# Altium schematic sheet main.SchDoc
size A4
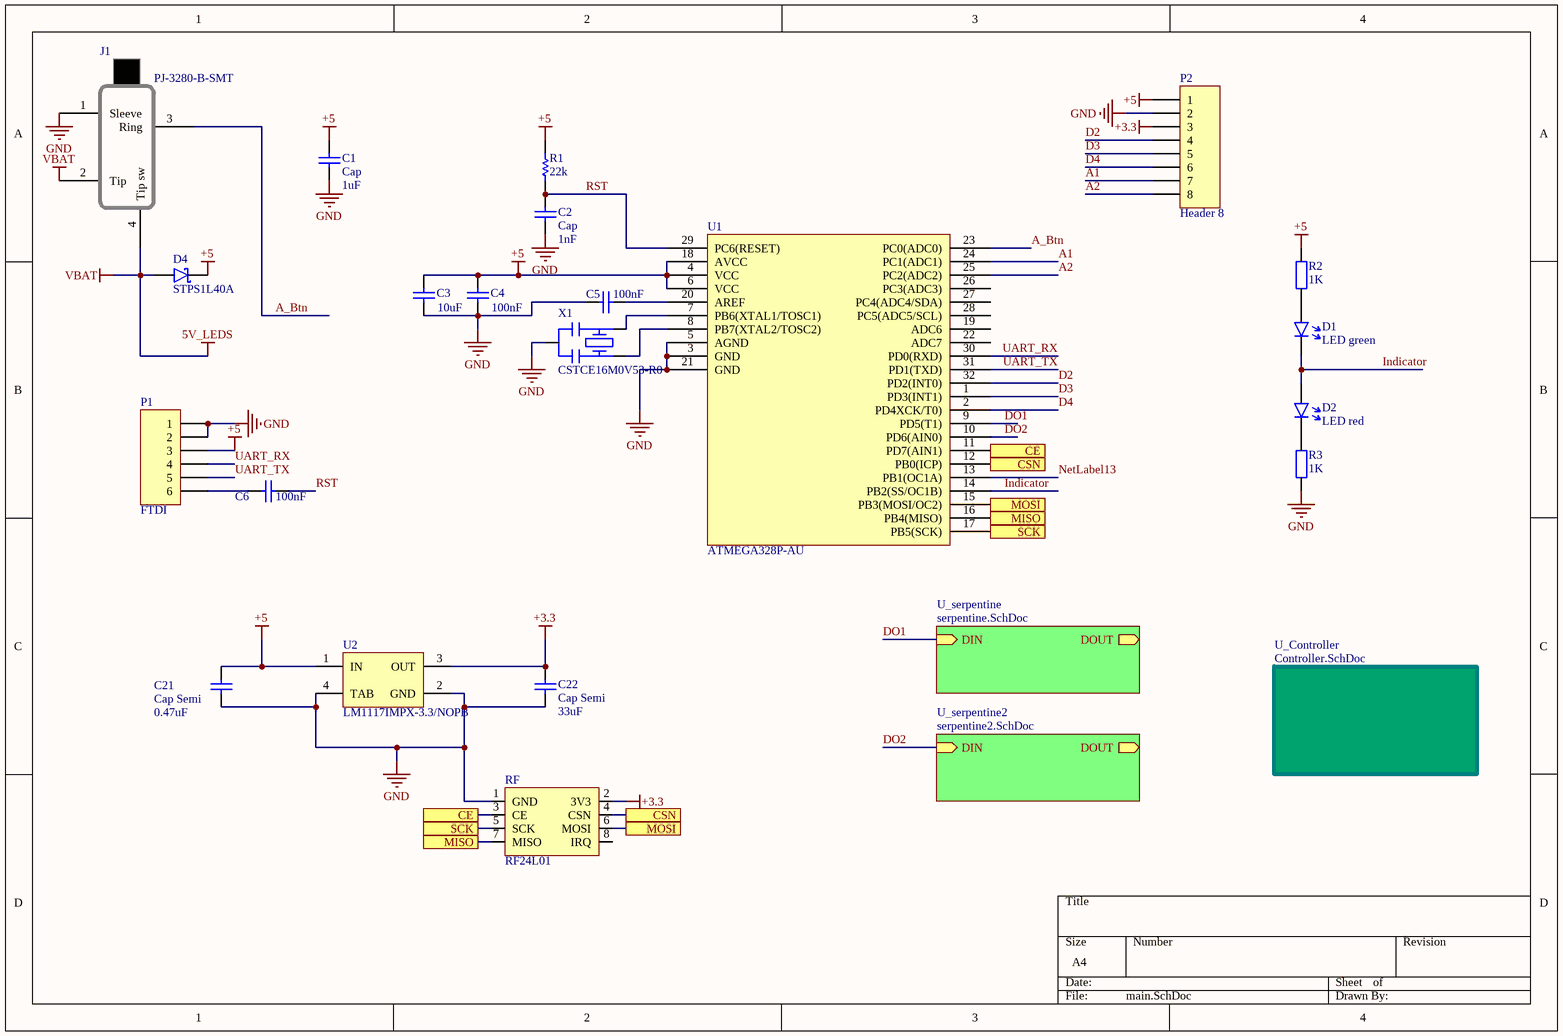
[diagram p0: main.SchDoc]

## Parts
C1  Cap  value 1uF  [6-0805_M]
C2  Cap  value 1nF  [6-0805_N]
C3  value 10uF  [6-0805_N]  (hidden comment: Cap)
C4  value 100nF  [6-0805_N]  (hidden comment: Cap)
C5  value 100nF  [6-0805_N]  (hidden comment: Cap)
C6  value 100nF  [6-0805_N]  (hidden comment: Cap)
C21  Cap Semi  value 0.47uF  [C1206]
C22  Cap Semi  value 33uF  [C1206]
D1  LED green  [LED0805]
D2  LED red  [LED0805]
D4  STPS1L40A  [schottky smd]
J1  PJ-3280-B-SMT  [Phonejack]
P1  FTDI  [HDR1X6H]
P2  Header 8  [HDR1X8]
R1  22k  [6-0805_N]
R2  1K  [RES0805]
R3  1K  [RES0805]
RF  RF24L01  [RF]
U1  ATMEGA328P-AU  [TQFP32]
U2  LM1117IMPX-3.3/NOPB  [DCY0004A_N]
X1  CSTCE16M0V53-R0  [osc]

## Sub-sheets
U_Controller = Controller.SchDoc: no entries
U_serpentine = serpentine.SchDoc: DIN (in), DOUT (out)
U_serpentine2 = serpentine2.SchDoc: DIN (in), DOUT (out)

## Ports
CE, CSN, MISO, MOSI, SCK

## Nets
5V_LEDS: D4.1(A) J1.2(Tip) J1.4(Tip_sw)  [also labelled VBAT]
+3.3: C22.2 P2.3 RF.2(3V3) U2.3(OUT)
+5: C1.1 C3.1 C4.1 C21.2 D4.2(C) P1.3 P2.1 R1.2 R2.1 U1.4(VCC) U1.6(VCC) U1.18(AVCC) U2.1(IN)
GND: C1.2 C2.1 C3.2 C4.2 C5.2 C21.1 C22.1 J1.1(Sleeve) P1.1 P1.2 P2.2 R3.2 RF.1(GND) U1.3(GND) U1.5(AGND) U1.21(GND) U2.2(GND) U2.4(TAB) X1.GND
A1: P2.7 U1.24(PC1(ADC1))
A2: P2.8 U1.25(PC2(ADC2))
A_Btn: J1.3(Ring) U1.23(PC0(ADC0))
CE: RF.3(CE) U1.11(PD7(AIN1)) ; port CE
CSN: RF.4(CSN) U1.12(PB0(ICP)) ; port CSN
D2: P2.4 U1.32(PD2(INT0))
D3: P2.5 U1.1(PD3(INT1))
D4: P2.6 U1.2(PD4XCK/T0))
DO1: U1.9(PD5(T1)) ; sheet U_serpentine/DIN
DO2: U1.10(PD6(AIN0)) ; sheet U_serpentine2/DIN
Indicator: D1.2 D2.1(A) U1.14(PB2(SS/OC1B))
MISO: RF.7(MISO) U1.16(PB4(MISO)) ; port MISO
MOSI: RF.6(MOSI) U1.15(PB3(MOSI/OC2)) ; port MOSI
NetLabel13: U1.13(PB1(OC1A))
RST: C2.2 C6.1 R1.1 U1.29(PC6(RESET))
SCK: RF.5(SCK) U1.17(PB5(SCK)) ; port SCK
UART_RX: P1.4 U1.30(PD0(RXD))
UART_TX: P1.5 U1.31(PD1(TXD))
NetC5_1: C5.1 U1.20(AREF)
NetC6_2: C6.2 P1.6
NetD1_1: D1.1(A) R2.2
NetD2_2: D2.2 R3.1
NetU1_7: U1.7(PB6(XTAL1/TOSC1)) X1.OSCO
NetU1_8: U1.8(PB7(XTAL2/TOSC2)) X1.OSCI

Not connected (* = marked no-connect by the designer): RF 8(IRQ); U1 19(ADC6) 22(ADC7) 26(PC3(ADC3)) 27(PC4(ADC4/SDA)) 28(PC5(ADC5/SCL))

## Library data of the parts
C1 = Cap: C107456; Published: 8-Jun-2000; LatestRevisionDate: 17-Jul-2002; LatestRevisionNote: Re-released for DXP Platform.; PackageReference: RAD-0.3; Publisher: Altium Limited; PackageDescription: Radial Cap, Thru-Hole; 2 Leads; 0.3 in Pin Spacing
C2 = Cap: C393688; Published: 8-Jun-2000; LatestRevisionDate: 17-Jul-2002; LatestRevisionNote: Re-released for DXP Platform.; PackageReference: RAD-0.3; Publisher: Altium Limited; PackageDescription: Radial Cap, Thru-Hole; 2 Leads; 0.3 in Pin Spacing
C3 = Cap: C40894; Published: 8-Jun-2000; LatestRevisionDate: 17-Jul-2002; LatestRevisionNote: Re-released for DXP Platform.; PackageReference: RAD-0.3; Publisher: Altium Limited; PackageDescription: Radial Cap, Thru-Hole; 2 Leads; 0.3 in Pin Spacing
C4-C6 = Cap: C282730; Published: 8-Jun-2000; LatestRevisionDate: 17-Jul-2002; LatestRevisionNote: Re-released for DXP Platform.; PackageReference: RAD-0.3; Publisher: Altium Limited; PackageDescription: Radial Cap, Thru-Hole; 2 Leads; 0.3 in Pin Spacing
C21 = Cap Semi: C161276; Published: 8-Jun-2000; LatestRevisionDate: 29-May-2009; LatestRevisionNote: IPC-7351 Footprint Added.; PackageReference: C1206; Publisher: Altium Limited; PackageDescription: Chip Capacitor
C22 = Cap Semi: C342307; Published: 8-Jun-2000; LatestRevisionDate: 29-May-2009; LatestRevisionNote: IPC-7351 Footprint Added.; PackageReference: C1206; Publisher: Altium Limited; PackageDescription: Chip Capacitor
D1 = LED single: C84260
D2 = LED single: C84256
D4 = schottky: C165940
J1 = Phonejack: C381130
P1 = Header 6H: Header, 6-Pin, Right Angle; LatestRevisionDate: 17-Jul-2002; LatestRevisionNote: Re-released for DXP Platform.; Publisher: Altium Limited
P2 = Header 8: Header, 8-Pin; LatestRevisionDate: 17-Jul-2002; LatestRevisionNote: Re-released for DXP Platform.; Publisher: Altium Limited
R1 = Res1: C269535; Published: 8-Jun-2000; LatestRevisionDate: 17-Jul-2002; LatestRevisionNote: Re-released for DXP Platform.; PackageReference: AXIAL-0.3; Publisher: Altium Limited; PackageDescription: Axial Device, Thru-Hole; 2 Leads; 0.3 in Pin Spacing; Value: 22k
R2 R3 = Resistor: C269744
U1 = ATmega328: C14877
U2 = CMP-0062-01784-3: C23984; Manufacturer: Texas Instruments; PowerWise: N; CompType: LDO IC; PackageTopMarking: XYTT*N00A; Code_IPC: SOT223-4; PackageReference: DCY0004A; ComponentLink1Description: Datasheet URL; PackageDescription: Molded SOT-223, 6.50 x 3.56 x 1.6mm Body, 4 Lead, 2.3mm Pitch; PinCount: 4; RoHS: Y; ComponentLink1URL: http://www.ti.com/general/docs/lit/getliterature.tsp?genericPartNumber=LM340-N&fileType=pdf; Code_JEDEC: TO-261-AA
X1 = xtal_1: C32180